# Altium schematic sheet Microcontroller.SchDoc
size A4; SheetNumber: 1; SheetTotal: 3
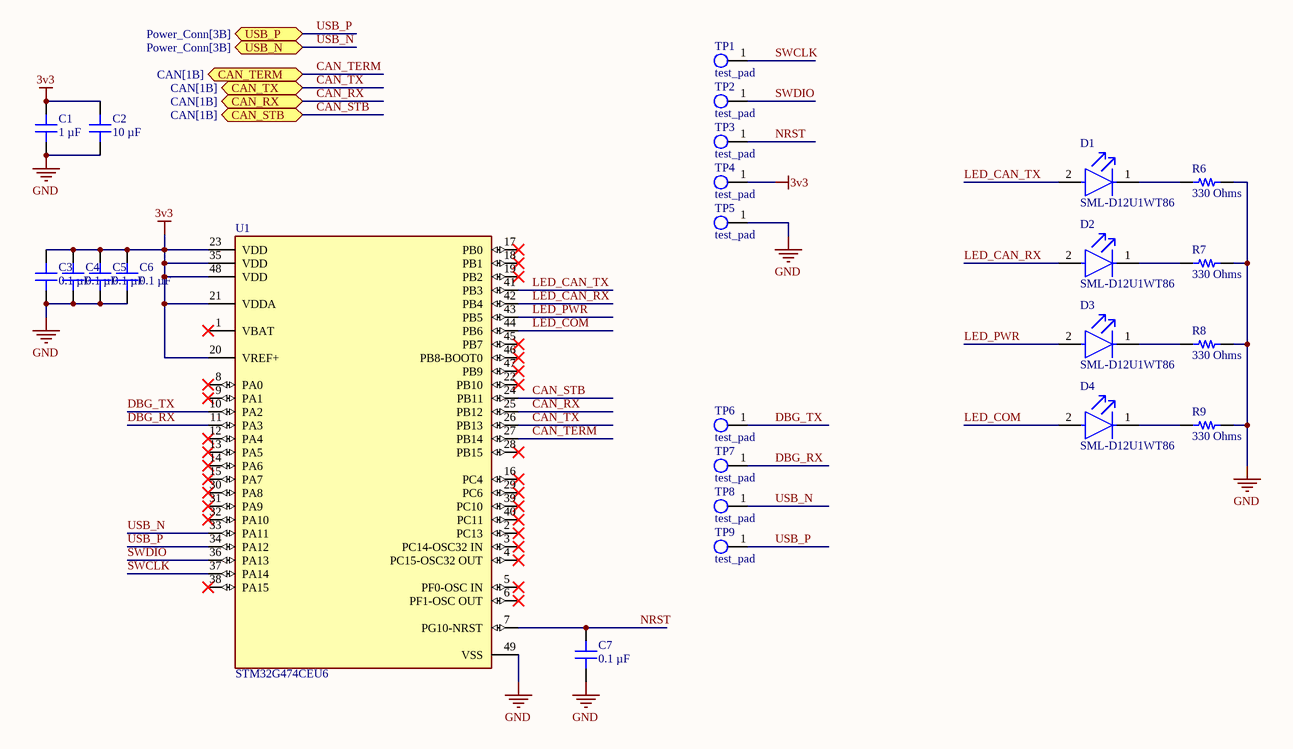
[diagram p0: Microcontroller.SchDoc]

## Parts
C1  1 µF  [CAP 0603_1608]
C2  10 µF  [CAP 0805_2012]
C3  0.1 µF  [CAP 0603_1608]
C4  0.1 µF  [CAP 0603_1608]
C5  0.1 µF  [CAP 0603_1608]
C6  0.1 µF  [CAP 0603_1608]
C7  0.1 µF  [CAP 0603_1608]
D1  SML-D12U1WT86  [FP-SML-D12-MFG]
D2  SML-D12U1WT86  [FP-SML-D12-MFG]
D3  SML-D12U1WT86  [FP-SML-D12-MFG]
D4  SML-D12U1WT86  [FP-SML-D12-MFG]
R6  330 Ohms  [RES 0603_1608]
R7  330 Ohms  [RES 0603_1608]
R8  330 Ohms  [RES 0603_1608]
R9  330 Ohms  [RES 0603_1608]
TP1  test_pad  [2mm TP]
TP2  test_pad  [2mm TP]
TP3  test_pad  [2mm TP]
TP4  test_pad  [2mm TP]
TP5  test_pad  [2mm TP]
TP6  test_pad  [2mm TP]
TP7  test_pad  [2mm TP]
TP8  test_pad  [2mm TP]
TP9  test_pad  [2mm TP]
U1  STM32G474CEU6  [FP-UFQFPN48-A0B9-IPC_C]

## Ports
CAN_RX (bidir, see CAN[1B]), CAN_STB (bidir, see CAN[1B]), CAN_TERM (bidir, see CAN[1B]), CAN_TX (bidir, see CAN[1B]), USB_N (bidir, see Power_Conn[3B]), USB_P (bidir, see Power_Conn[3B])

## Nets
3v3: C1.2 C2.2 C3.2 C4.2 C5.2 C6.2 TP4.1 U1.20(VREF+) U1.21(VDDA) U1.23(VDD) U1.35(VDD) U1.48(VDD)
GND: C1.1 C2.1 C3.1 C4.1 C5.1 C6.1 C7.1 R6.1 R7.1 R8.1 R9.1 TP5.1 U1.49(VSS)
CAN_RX: U1.25(PB12) ; port CAN_RX
CAN_STB: U1.24(PB11) ; port CAN_STB
CAN_TERM: U1.27(PB14) ; port CAN_TERM
CAN_TX: U1.26(PB13) ; port CAN_TX
DBG_RX: TP7.1 U1.11(PA3)
DBG_TX: TP6.1 U1.10(PA2)
LED_CAN_RX: D2.2(A) U1.42(PB4)
LED_CAN_TX: D1.2(A) U1.41(PB3)
LED_COM: D4.2(A) U1.44(PB6)
LED_PWR: D3.2(A) U1.43(PB5)
NRST: C7.2 TP3.1 U1.7(PG10-NRST)
SWCLK: TP1.1 U1.37(PA14)
SWDIO: TP2.1 U1.36(PA13)
USB_N: TP8.1 U1.33(PA11) ; port USB_N
USB_P: TP9.1 U1.34(PA12) ; port USB_P
NetD1_1: D1.1(C) R6.2
NetD2_1: D2.1(C) R7.2
NetD3_1: D3.1(C) R8.2
NetD4_1: D4.1(C) R9.2

Not connected (* = marked no-connect by the designer): U1 1(VBAT)* 2(PC13)* 3(PC14-OSC32_IN)* 4(PC15-OSC32_OUT)* 5(PF0-OSC_IN)* 6(PF1-OSC_OUT)* 8(PA0)* 9(PA1)* 12(PA4)* 13(PA5)* 14(PA6)* 15(PA7)* 16(PC4)* 17(PB0)* 18(PB1)* 19(PB2)* 22(PB10)* 28(PB15)* 29(PC6)* 30(PA8)* 31(PA9)* 32(PA10)* 38(PA15)* 39(PC10)* 40(PC11)* 45(PB7)* 46(PB8-BOOT0)* 47(PB9)*

## Library data of the parts
C1 = CL10B105KP8NFNC: CAP CER 1UF 10V X7R 0603; manufacturer: Samsung Electro-Mechanics; Tolerance: ±10%; Part Number: CL10B105KP8NFNC; Value: 1 µF; Applications: General Purpose; Capacitance: 1 µF; componentlink1description: Datasheet; componentlink1url: http://www.samsungsem.com/kr/support/product-search/mlcc/CL10B105KP8NFNC.jsp; componentlink2description: DigiKey Link; componentlink2url: https://www.digikey.com/en/products/detail/samsung-electro-mechanics/CL10B105KP8NFNC/3887603; Device Package: 0603 (1608 Metric); lastupdated: 2023-11-08 8:08:57 PM; Lifecycle Status: Active; Minimum Order: 1; Mounting Type: Surface Mount, MLCC; Operating Temperature: -55°C ~ 125°C; Package / Case: 0603 (1608 Metric); packaging: TapeAndReel; partid: 10019; Part Status: Active; price: 0.01; series: CL; Size / Dimension: 0.063" L x 0.031" W (1.60mm x 0.80mm); Supplier 1: DigiKey; Supplier Part Number 1: 1276-1945-1-ND; Temperature Coefficient: X7R; Thickness (Max): 0.035" (0.90mm); Voltage - Rated: 10V
C2 = CL21A106KOQNNNE: CAP CER 10UF 16V X5R 0805; manufacturer: Samsung Electro-Mechanics; Tolerance: ±10%; Part Number: CL21A106KOQNNNE; Value: 10 µF; Applications: General Purpose; Capacitance: 10 µF; componentlink1description: Datasheet; componentlink1url: http://www.samsungsem.com/kr/support/product-search/mlcc/CL21A106KOQNNNE.jsp; componentlink2description: DigiKey Link; componentlink2url: https://www.digikey.com/en/products/detail/samsung-electro-mechanics/CL21A106KOQNNNE/3886754; Device Package: 0805 (2012 Metric); lastupdated: 2023-11-08 8:12:18 PM; Lifecycle Status: Active; Minimum Order: 1; Mounting Type: Surface Mount, MLCC; Operating Temperature: -55°C ~ 85°C; Package / Case: 0805 (2012 Metric); packaging: TapeAndReel; partid: 14297; Part Status: Active; price: 0.01; series: CL; Size / Dimension: 0.079" L x 0.049" W (2.00mm x 1.25mm); Supplier 1: DigiKey; Supplier Part Number 1: 1276-1096-1-ND; Temperature Coefficient: X5R; Thickness (Max): 0.055" (1.40mm); Voltage - Rated: 16V
C3-C7 = CL10B104KB8NNNC: CAP CER 0.1UF 50V X7R 0603; manufacturer: Samsung Electro-Mechanics; Tolerance: ±10%; Part Number: CL10B104KB8NNNC; Value: 0.1 µF; Applications: General Purpose; Capacitance: 0.1 µF; componentlink1description: Datasheet; componentlink1url: http://www.samsungsem.com/kr/support/product-search/mlcc/CL10B104KB8NNNC.jsp; componentlink2description: DigiKey Link; componentlink2url: https://www.digikey.com/en/products/detail/samsung-electro-mechanics/CL10B104KB8NNNC/3886658; Device Package: 0603 (1608 Metric); lastupdated: 2023-11-08 8:08:57 PM; Lifecycle Status: Active; Minimum Order: 1; Mounting Type: Surface Mount, MLCC; Operating Temperature: -55°C ~ 125°C; Package / Case: 0603 (1608 Metric); packaging: TapeAndReel; partid: 9788; Part Status: Active; price: 0.01; series: CL; Size / Dimension: 0.063" L x 0.031" W (1.60mm x 0.80mm); Supplier 1: DigiKey; Supplier Part Number 1: 1276-1000-1-ND; Temperature Coefficient: X7R; Thickness (Max): 0.035" (0.90mm); Voltage - Rated: 50V
D1-D4 = CMP-08952-000009-1: LED RED DIFFUSED 1608 SMD; Manufacturer: Rohm; Led Orientation: Top View; Power Dissipation: 54mW; Forward Current: 20mA; Wavelength: 620nm; Reverse Voltage: 5V; Luminous Intensity: 63mcd; Forward Voltage: 2.2V; Description: Red 620nm LED Indication - Discrete 2.2V 0603 (1608 Metric); Mouser Description: SML-D12 Series Red 0603 Diffused 63 mcd 2.2 V Surface Mount LED; Temperature: -40°C to +85°C; Device Class L2: LEDs; Lead Free: Yes; Automotive: No; Octopart: https://octopart.com/sml-d12u1wt86-rohm-70850259; RoHS: TRUE; Colour: Red; Digikey Description: LED RED DIFFUSED 1608 SMD; Package: SML-D12; Device Class L1: Optoelectronics; Category: Diode; Temperature Range High: +85°C; Height: 0.65mm; ComponentLink2Description: Datasheet; Temperature Range Low: -40°C; ComponentLink2URL: https://www.rohm.com/datasheet/SML-D12U1W/sml-d12x1-e; Manufacturer Part Number: SML-D12U1WT86; Device Class L3: unset
R6-R9 = CR0603-JW-331ELF: RES SMD 330 OHM 5% 1/10W 0603; Manufacturer: Bourns Inc.; Power (Watts): 0.1W, 1/10W; Temperature Coefficient: ±200ppm/°C; Part Number: CR0603-JW-331ELF; Value: 330 Ohms; ComponentLink1Description: Datasheet; ComponentLink1URL: https://www.bourns.com/docs/Product-Datasheets/CHPREZTR.pdf; ComponentLink2Description: DigiKey Link; ComponentLink2URL: https://www.digikey.com/en/products/detail/bourns-inc/CR0603-JW-331ELF/2345095; Composition: Thick Film; Device Package: 0603 (1608 Metric); Features: Moisture Resistant; Height - Seated (Max): 0.022" (0.55mm); LastUpdated: 2023-11-08 8:34:22 PM; Lifecycle Status: Active; Minimum Order: 1; Number of Terminations: 2; Operating Temperature: -55°C ~ 155°C; Package / Case: 0603 (1608 Metric); Packaging: CutTape; PartId: 25660; Part Status: Active; Price: 0.01; Resistance: 330 Ohms; Series: CR0603; Size / Dimension: 0.063" L x 0.031" W (1.60mm x 0.80mm); Supplier 1: DigiKey; Supplier Part Number 1: CR0603-JW-331ELFCT-ND; Supplier Device Package: 0603; Tolerance: ±5%
TP1-TP9 = test_pad: Test pad for ICT
U1 = CMP-12105-000082-1: MAINSTREAM ARM CORTEX-M4 CORE WI